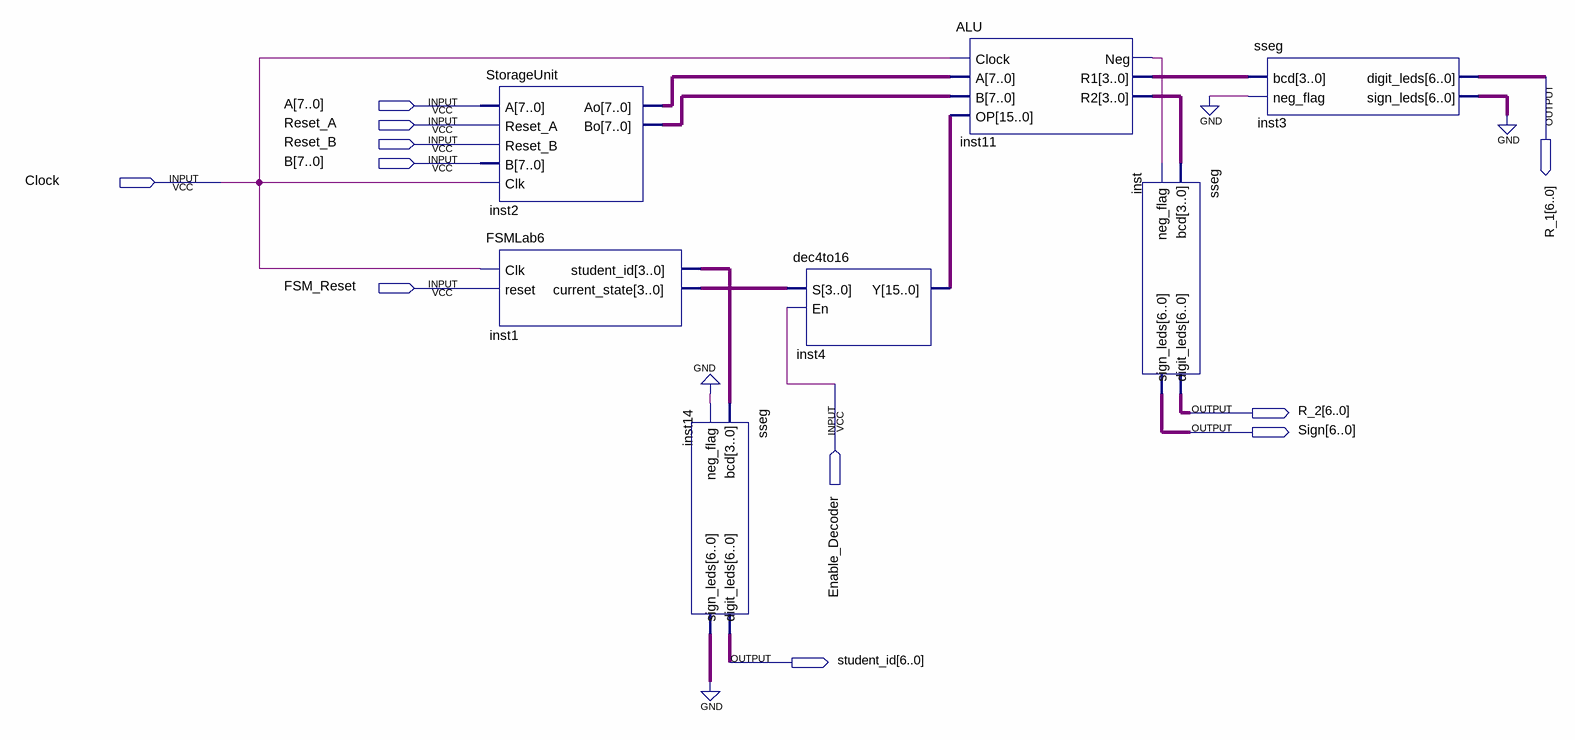
[diagram p0: schematic sheet]
// Quartus schematic lab6_part2_d.bdf as structural Verilog: 7 symbols, 11 pins
module lab6_part2_d (
  input  [7:0] A,
  input  Reset_A,
  input  Reset_B,
  input  [7:0] B,
  input  Clock,
  input  FSM_Reset,
  input  Enable_Decoder,
  output [6:0] R_1,
  output [6:0] R_2,
  output [6:0] Sign,
  output [6:0] student_id
);

  wire inst11_neg;
  wire [3:0] inst1_current_state, inst1_student_id, inst11_r1, inst11_r2;
  wire [6:0] inst3_sign_leds, inst14_sign_leds;
  wire [7:0] inst2_ao, inst2_bo;
  wire [15:0] inst4_y;

  StorageUnit inst2 (.A(A), .Reset_A(Reset_A), .Reset_B(Reset_B), .B(B), .Clk(Clock), .Ao(inst2_ao), .Bo(inst2_bo));
  FSMLab6 inst1 (.Clk(Clock), .reset(FSM_Reset), .student_id(inst1_student_id), .current_state(inst1_current_state));
  sseg inst14 (.bcd(inst1_student_id), .neg_flag(1'b0), .digit_leds(student_id), .sign_leds(inst14_sign_leds));
  dec4to16 inst4 (.S(inst1_current_state), .En(Enable_Decoder), .Y(inst4_y));
  ALU inst11 (
    .Clock(Clock), .A(inst2_ao), .B(inst2_bo), .OP(inst4_y), .Neg(inst11_neg), .R1(inst11_r1), .R2(inst11_r2));
  sseg inst (.bcd(inst11_r2), .neg_flag(inst11_neg), .digit_leds(R_2), .sign_leds(Sign));
  sseg inst3 (.bcd(inst11_r1), .neg_flag(1'b0), .digit_leds(R_1), .sign_leds(inst3_sign_leds));
  // also tied to GND on the sheet: {inst14_sign_leds[0], inst14_sign_leds[1], inst14_sign_leds[2], inst14_sign_leds[3], inst14_sign_leds[4], inst14_sign_leds[5], inst14_sign_leds[6], inst3_sign_leds[0], inst3_sign_leds[1], inst3_sign_leds[2], inst3_sign_leds[3], inst3_sign_leds[4], inst3_sign_leds[5], inst3_sign_leds[6]}
endmodule
